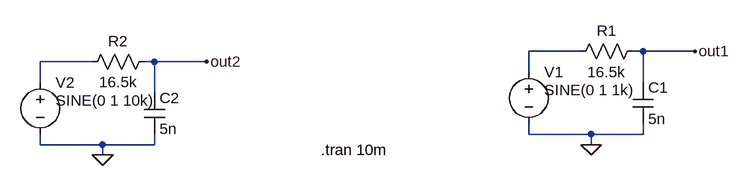
[diagram p0: schematic low_pass_filter_updated.asc]
low_pass_filter_updated.asc, the LTspice schematic file:
Version 4
SHEET 1 880 680
WIRE 160 112 80 112
WIRE 256 112 240 112
WIRE 336 112 256 112
WIRE -592 128 -672 128
WIRE -496 128 -512 128
WIRE -416 128 -496 128
WIRE 80 144 80 112
WIRE -672 160 -672 128
WIRE 256 160 256 112
WIRE -496 176 -496 128
WIRE 80 240 80 224
WIRE 176 240 80 240
WIRE 256 240 256 224
WIRE 256 240 176 240
WIRE -672 256 -672 240
WIRE -576 256 -672 256
WIRE -496 256 -496 240
WIRE -496 256 -576 256
WIRE 176 256 176 240
WIRE -576 272 -576 256
FLAG 176 256 0
FLAG 336 112 out1
FLAG -576 272 0
FLAG -416 128 out2
SYMBOL cap 240 160 R0
SYMATTR InstName C1
SYMATTR Value 5n
SYMBOL res 256 96 R90
WINDOW 0 0 56 VBottom 2
WINDOW 3 32 56 VTop 2
SYMATTR InstName R1
SYMATTR Value 16.5k
SYMBOL voltage 80 128 R0
WINDOW 123 24 124 Left 2
WINDOW 39 0 0 Left 0
WINDOW 3 24 44 Left 2
SYMATTR InstName V1
SYMATTR Value SINE(0 1 1k)
SYMBOL cap -512 176 R0
SYMATTR InstName C2
SYMATTR Value 5n
SYMBOL res -496 112 R90
WINDOW 0 0 56 VBottom 2
WINDOW 3 32 56 VTop 2
SYMATTR InstName R2
SYMATTR Value 16.5k
SYMBOL voltage -672 144 R0
WINDOW 123 24 124 Left 2
WINDOW 39 0 0 Left 0
WINDOW 3 24 44 Left 2
SYMATTR InstName V2
SYMATTR Value SINE(0 1 10k)
TEXT -240 264 Left 2 !.tran 10m

The netlist it stands for:
* low_pass_filter_updated.asc
C1 out1 0 5n
R1 out1 N001 16.5k
V1 N001 0 SINE(0 1 1k)
C2 out2 0 5n
R2 out2 N002 16.5k
V2 N002 0 SINE(0 1 10k)
.tran 10m
.backanno
.end